# Altium schematic sheet DSDPLC_IO.SchDoc: DSD_PLC
size A3; Author: Nicolás Velásquez; CompanyName: DeepSea Developments
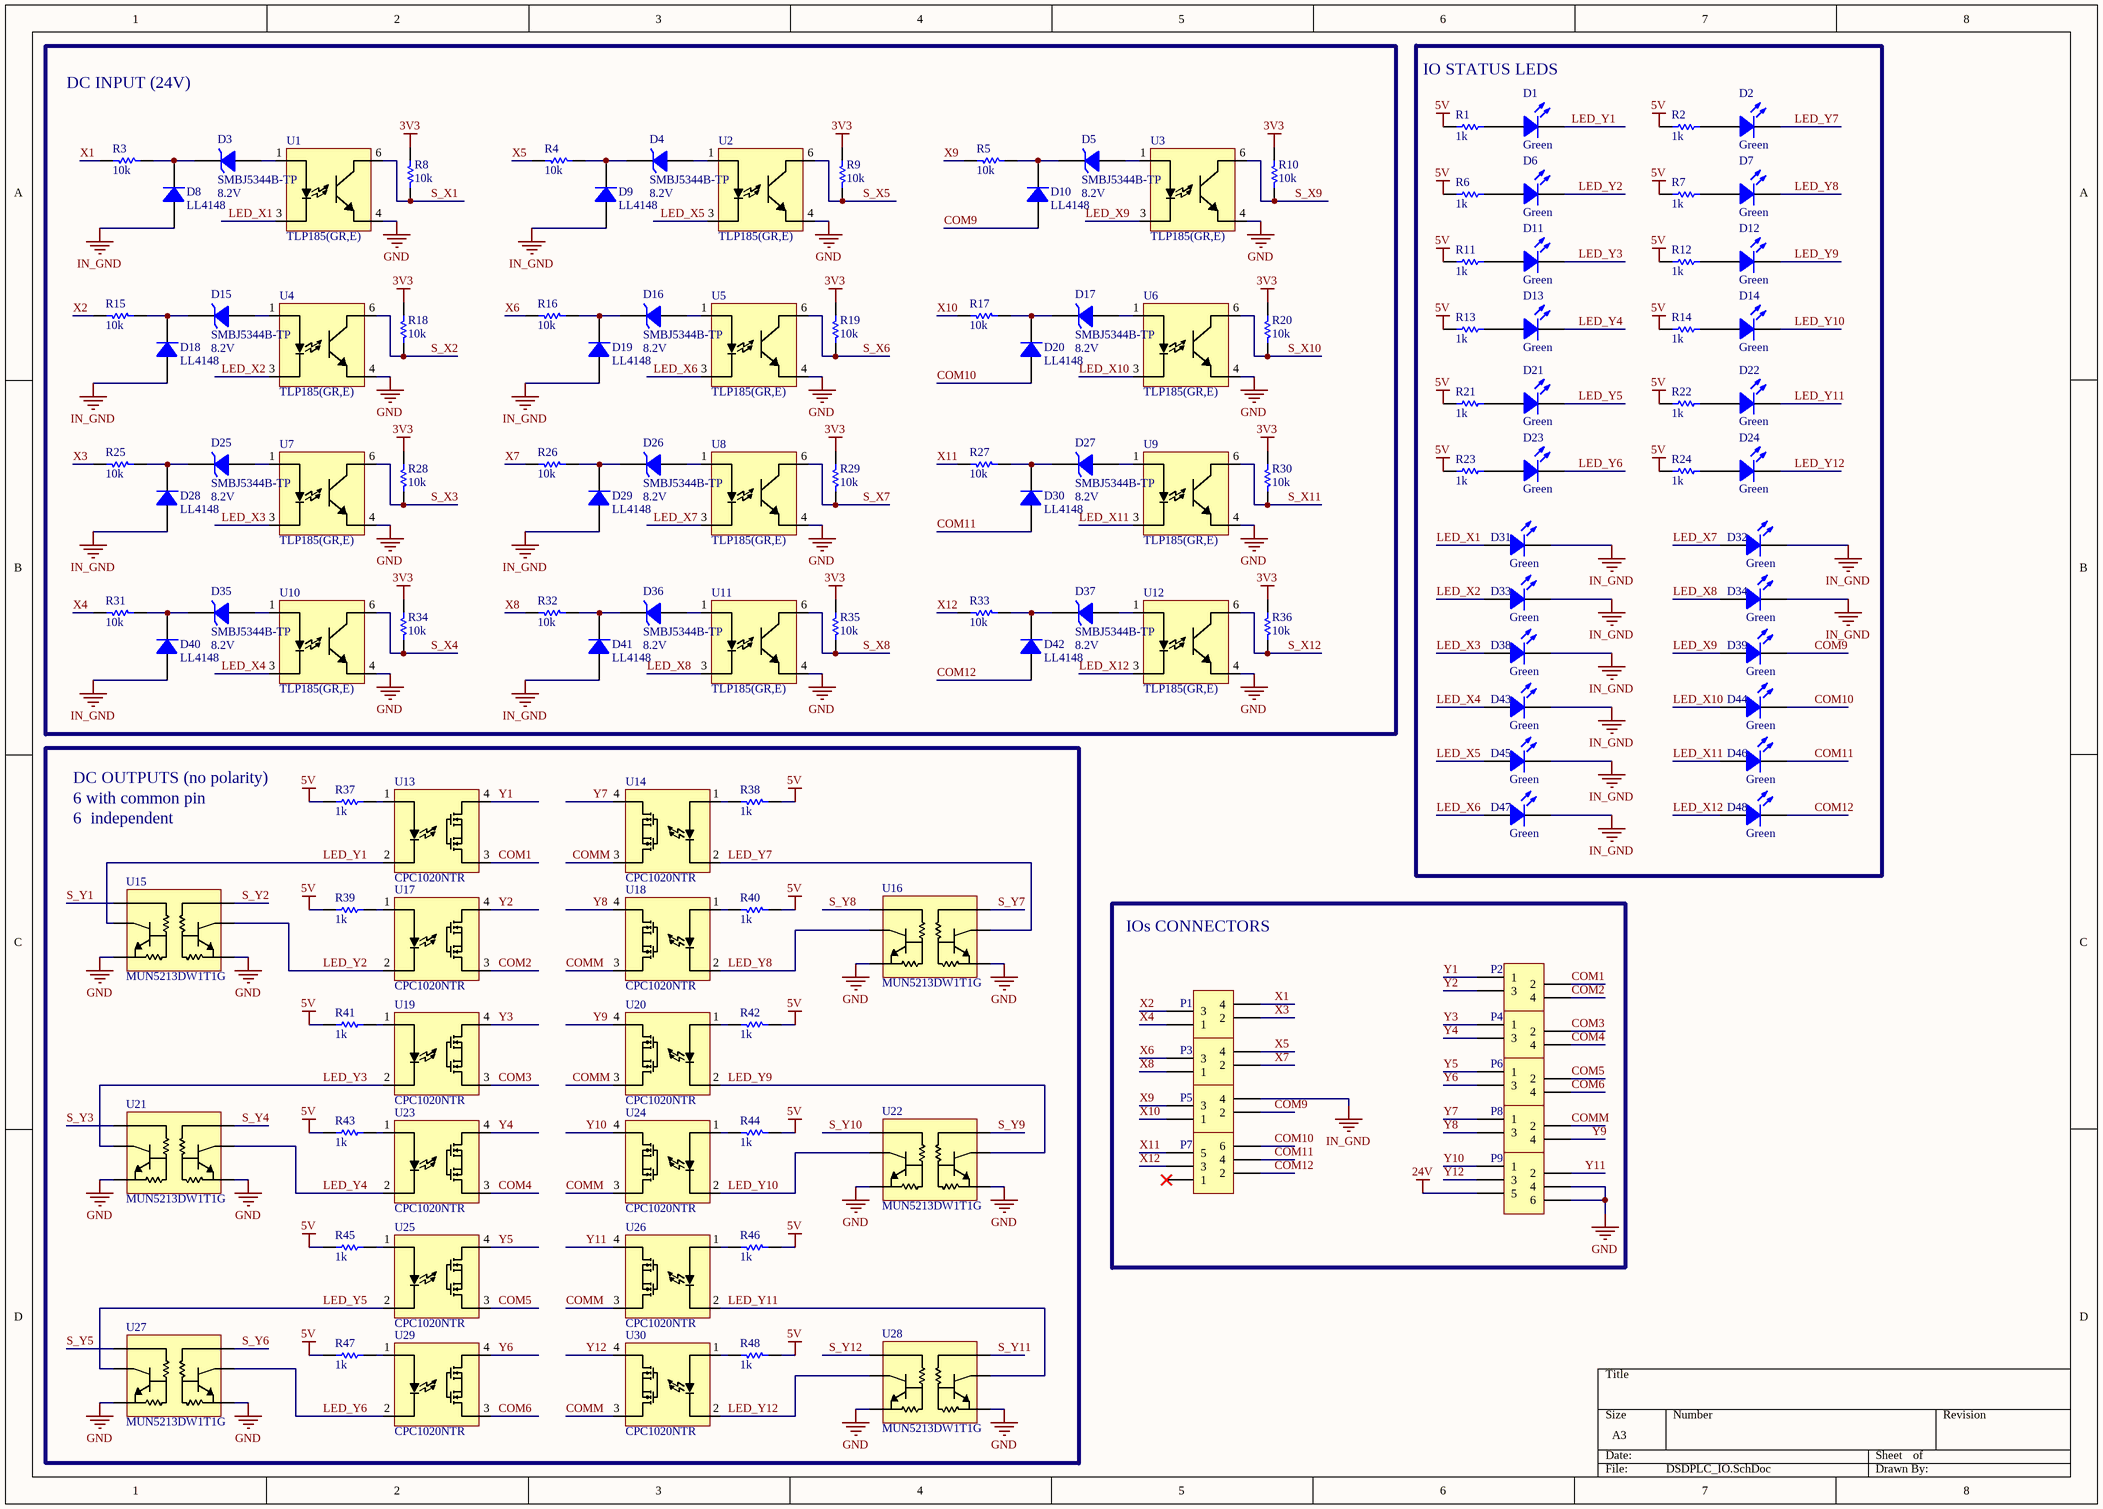
[diagram p0: DSDPLC_IO.SchDoc]

## Parts
D1  Green  [R0603_N]
D2  Green  [R0603_N]
D3  SMBJ5344B-TP  Voltage - Zener (Nom) (Vz): 8.2V  [SMB_N]
D4  SMBJ5344B-TP  Voltage - Zener (Nom) (Vz): 8.2V  [SMB_N]
D5  SMBJ5344B-TP  Voltage - Zener (Nom) (Vz): 8.2V  [SMB_N]
D6  Green  [R0603_N]
D7  Green  [R0603_N]
D8  LL4148  [SOD-80_N]
D9  LL4148  [SOD-80_N]
D10  LL4148  [SOD-80_N]
D11  Green  [R0603_N]
D12  Green  [R0603_N]
D13  Green  [R0603_N]
D14  Green  [R0603_N]
D15  SMBJ5344B-TP  Voltage - Zener (Nom) (Vz): 8.2V  [SMB_N]
D16  SMBJ5344B-TP  Voltage - Zener (Nom) (Vz): 8.2V  [SMB_N]
D17  SMBJ5344B-TP  Voltage - Zener (Nom) (Vz): 8.2V  [SMB_N]
D18  LL4148  [SOD-80_N]
D19  LL4148  [SOD-80_N]
D20  LL4148  [SOD-80_N]
D21  Green  [R0603_N]
D22  Green  [R0603_N]
D23  Green  [R0603_N]
D24  Green  [R0603_N]
D25  SMBJ5344B-TP  Voltage - Zener (Nom) (Vz): 8.2V  [SMB_N]
D26  SMBJ5344B-TP  Voltage - Zener (Nom) (Vz): 8.2V  [SMB_N]
D27  SMBJ5344B-TP  Voltage - Zener (Nom) (Vz): 8.2V  [SMB_N]
D28  LL4148  [SOD-80_N]
D29  LL4148  [SOD-80_N]
D30  LL4148  [SOD-80_N]
D31  Green  [R0603_N]
D32  Green  [R0603_N]
D33  Green  [R0603_N]
D34  Green  [R0603_N]
D35  SMBJ5344B-TP  Voltage - Zener (Nom) (Vz): 8.2V  [SMB_N]
D36  SMBJ5344B-TP  Voltage - Zener (Nom) (Vz): 8.2V  [SMB_N]
D37  SMBJ5344B-TP  Voltage - Zener (Nom) (Vz): 8.2V  [SMB_N]
D38  Green  [R0603_N]
D39  Green  [R0603_N]
D40  LL4148  [SOD-80_N]
D41  LL4148  [SOD-80_N]
D42  LL4148  [SOD-80_N]
D43  Green  [R0603_N]
D44  Green  [R0603_N]
D45  Green  [R0603_N]
D46  Green  [R0603_N]
D47  Green  [R0603_N]
D48  Green  [R0603_N]
P1  BLOCK_CONN2X2  [block_conn 2 x 2]  (value not drawn)
P2  BLOCK_CONN2X2  [block_conn 2 x 2]  (value not drawn)
P3  BLOCK_CONN2X2  [block_conn 2 x 2]  (value not drawn)
P4  BLOCK_CONN2X2  [block_conn 2 x 2]  (value not drawn)
P5  BLOCK_CONN2X2  [block_conn 2 x 2]  (value not drawn)
P6  BLOCK_CONN2X2  [block_conn 2 x 2]  (value not drawn)
P7  BLOCK_CONN2X3  [block_conn 2 x 3]  (value not drawn)
P8  BLOCK_CONN2X2  [block_conn 2 x 2]  (value not drawn)
P9  BLOCK_CONN2X3  [block_conn 2 x 3]  (value not drawn)
R1  value 1k  [R0603_N]  (hidden comment: R_SMD)
R2  value 1k  [R0603_N]  (hidden comment: R_SMD)
R3  value 10k  [R0603_N]  (hidden comment: R_SMD)
R4  value 10k  [R0603_N]  (hidden comment: R_SMD)
R5  value 10k  [R0603_N]  (hidden comment: R_SMD)
R6  value 1k  [R0603_N]  (hidden comment: R_SMD)
R7  value 1k  [R0603_N]  (hidden comment: R_SMD)
R8  value 10k  [R0603_N]  (hidden comment: R_SMD)
R9  value 10k  [R0603_N]  (hidden comment: R_SMD)
R10  value 10k  [R0603_N]  (hidden comment: R_SMD)
R11  value 1k  [R0603_N]  (hidden comment: R_SMD)
R12  value 1k  [R0603_N]  (hidden comment: R_SMD)
R13  value 1k  [R0603_N]  (hidden comment: R_SMD)
R14  value 1k  [R0603_N]  (hidden comment: R_SMD)
R15  value 10k  [R0603_N]  (hidden comment: R_SMD)
R16  value 10k  [R0603_N]  (hidden comment: R_SMD)
R17  value 10k  [R0603_N]  (hidden comment: R_SMD)
R18  value 10k  [R0603_N]  (hidden comment: R_SMD)
R19  value 10k  [R0603_N]  (hidden comment: R_SMD)
R20  value 10k  [R0603_N]  (hidden comment: R_SMD)
R21  value 1k  [R0603_N]  (hidden comment: R_SMD)
R22  value 1k  [R0603_N]  (hidden comment: R_SMD)
R23  value 1k  [R0603_N]  (hidden comment: R_SMD)
R24  value 1k  [R0603_N]  (hidden comment: R_SMD)
R25  value 10k  [R0603_N]  (hidden comment: R_SMD)
R26  value 10k  [R0603_N]  (hidden comment: R_SMD)
R27  value 10k  [R0603_N]  (hidden comment: R_SMD)
R28  value 10k  [R0603_N]  (hidden comment: R_SMD)
R29  value 10k  [R0603_N]  (hidden comment: R_SMD)
R30  value 10k  [R0603_N]  (hidden comment: R_SMD)
R31  value 10k  [R0603_N]  (hidden comment: R_SMD)
R32  value 10k  [R0603_N]  (hidden comment: R_SMD)
R33  value 10k  [R0603_N]  (hidden comment: R_SMD)
R34  value 10k  [R0603_N]  (hidden comment: R_SMD)
R35  value 10k  [R0603_N]  (hidden comment: R_SMD)
R36  value 10k  [R0603_N]  (hidden comment: R_SMD)
R37  value 1k  [R0603_N]  (hidden comment: R_SMD)
R38  value 1k  [R0603_N]  (hidden comment: R_SMD)
R39  value 1k  [R0603_N]  (hidden comment: R_SMD)
R40  value 1k  [R0603_N]  (hidden comment: R_SMD)
R41  value 1k  [R0603_N]  (hidden comment: R_SMD)
R42  value 1k  [R0603_N]  (hidden comment: R_SMD)
R43  value 1k  [R0603_N]  (hidden comment: R_SMD)
R44  value 1k  [R0603_N]  (hidden comment: R_SMD)
R45  value 1k  [R0603_N]  (hidden comment: R_SMD)
R46  value 1k  [R0603_N]  (hidden comment: R_SMD)
R47  value 1k  [R0603_N]  (hidden comment: R_SMD)
R48  value 1k  [R0603_N]  (hidden comment: R_SMD)
U1  TLP185(GR,E)  [SOIC6 (4 leads)]
U2  TLP185(GR,E)  [SOIC6 (4 leads)]
U3  TLP185(GR,E)  [SOIC6 (4 leads)]
U4  TLP185(GR,E)  [SOIC6 (4 leads)]
U5  TLP185(GR,E)  [SOIC6 (4 leads)]
U6  TLP185(GR,E)  [SOIC6 (4 leads)]
U7  TLP185(GR,E)  [SOIC6 (4 leads)]
U8  TLP185(GR,E)  [SOIC6 (4 leads)]
U9  TLP185(GR,E)  [SOIC6 (4 leads)]
U10  TLP185(GR,E)  [SOIC6 (4 leads)]
U11  TLP185(GR,E)  [SOIC6 (4 leads)]
U12  TLP185(GR,E)  [SOIC6 (4 leads)]
U13  CPC1020NTR  [SOP4_N]
U14  CPC1020NTR  [SOP4_N]
U15  MUN5213DW1T1G  [SOT363_N]
U16  MUN5213DW1T1G  [SOT363_N]
U17  CPC1020NTR  [SOP4_N]
U18  CPC1020NTR  [SOP4_N]
U19  CPC1020NTR  [SOP4_N]
U20  CPC1020NTR  [SOP4_N]
U21  MUN5213DW1T1G  [SOT363_N]
U22  MUN5213DW1T1G  [SOT363_N]
U23  CPC1020NTR  [SOP4_N]
U24  CPC1020NTR  [SOP4_N]
U25  CPC1020NTR  [SOP4_N]
U26  CPC1020NTR  [SOP4_N]
U27  MUN5213DW1T1G  [SOT363_N]
U28  MUN5213DW1T1G  [SOT363_N]
U29  CPC1020NTR  [SOP4_N]
U30  CPC1020NTR  [SOP4_N]

## Blocks framed on the sheet
DC INPUT (24V): D3-D5 D8-D10 D15-D20 D25-D30 D35-D37 D40-D42 R3-R5 R8-R10 R15-R20 R25-R36 U1-U12
IO STATUS LEDS: D1 D2 D6 D7 D11-D14 D21-D24 D31-D34 D38 D39 D43-D48 R1 R2 R6 R7 R11-R14 R21-R24
IOs CONNECTORS: P1-P9

## Nets
3V3: R8.2 R9.2 R10.2 R18.2 R19.2 R20.2 R28.2 R29.2 R30.2 R34.2 R35.2 R36.2
5V: R1.1 R2.1 R6.1 R7.1 R11.1 R12.1 R13.1 R14.1 R21.1 R22.1 R23.1 R24.1 R37.2 R38.2 R39.2 R40.2 R41.2 R42.2 R43.2 R44.2 R45.2 R46.2 R47.2 R48.2
24V: P9.5
GND: P9.4 P9.6 U1.4(DC-) U2.4(DC-) U3.4(DC-) U4.4(DC-) U5.4(DC-) U6.4(DC-) U7.4(DC-) U8.4(DC-) U9.4(DC-) U10.4(DC-) U11.4(DC-) U12.4(DC-) U15.1 U15.4 U16.1 U16.4 U21.1 U21.4 U22.1 U22.4 U27.1 U27.4 U28.1 U28.4
IN_GND: D8.1(A) D9.1(A) D18.1(A) D19.1(A) D28.1(A) D29.1(A) D31.2(K) D32.2(K) D33.2(K) D34.2(K) D38.2(K) D40.1(A) D41.1(A) D43.2(K) D45.2(K) D47.2(K) P5.4
COM1: P2.2 U13.3(DC-)
COM2: P2.4 U17.3(DC-)
COM3: P4.2 U19.3(DC-)
COM4: P4.4 U23.3(DC-)
COM5: P6.2 U25.3(DC-)
COM6: P6.4 U29.3(DC-)
COM9: D10.1(A) D39.2(K) P5.2
COM10: D20.1(A) D44.2(K) P7.6
COM11: D30.1(A) D46.2(K) P7.4
COM12: D42.1(A) D48.2(K) P7.2
COMM: P8.2 U14.3(DC-) U18.3(DC-) U20.3(DC-) U24.3(DC-) U26.3(DC-) U30.3(DC-)
LED_X1: D31.1(A) U1.3(control-)
LED_X2: D33.1(A) U4.3(control-)
LED_X3: D38.1(A) U7.3(control-)
LED_X4: D43.1(A) U10.3(control-)
LED_X5: D45.1(A) U2.3(control-)
LED_X6: D47.1(A) U5.3(control-)
LED_X7: D32.1(A) U8.3(control-)
LED_X8: D34.1(A) U11.3(control-)
LED_X9: D39.1(A) U3.3(control-)
LED_X10: D44.1(A) U6.3(control-)
LED_X11: D46.1(A) U9.3(control-)
LED_X12: D48.1(A) U12.3(control-)
LED_Y1: D1.2(K) U13.2(control-) U15.6(b)
LED_Y2: D6.2(K) U15.3 U17.2(control-)
LED_Y3: D11.2(K) U19.2(control-) U21.6(b)
LED_Y4: D13.2(K) U21.3 U23.2(control-)
LED_Y5: D21.2(K) U25.2(control-) U27.6(b)
LED_Y6: D23.2(K) U27.3 U29.2(control-)
LED_Y7: D2.2(K) U14.2(control-) U16.6(b)
LED_Y8: D7.2(K) U16.3 U18.2(control-)
LED_Y9: D12.2(K) U20.2(control-) U22.6(b)
LED_Y10: D14.2(K) U22.3 U24.2(control-)
LED_Y11: D22.2(K) U26.2(control-) U28.6(b)
LED_Y12: D24.2(K) U28.3 U30.2(control-)
S_X1: R8.1 U1.6(DC+)
S_X2: R18.1 U4.6(DC+)
S_X3: R28.1 U7.6(DC+)
S_X4: R34.1 U10.6(DC+)
S_X5: R9.1 U2.6(DC+)
S_X6: R19.1 U5.6(DC+)
S_X7: R29.1 U8.6(DC+)
S_X8: R35.1 U11.6(DC+)
S_X9: R10.1 U3.6(DC+)
S_X10: R20.1 U6.6(DC+)
S_X11: R30.1 U9.6(DC+)
S_X12: R36.1 U12.6(DC+)
S_Y1: U15.2
S_Y2: U15.5
S_Y3: U21.2
S_Y4: U21.5
S_Y5: U27.2
S_Y6: U27.5
S_Y7: U16.2
S_Y8: U16.5
S_Y9: U22.2
S_Y10: U22.5
S_Y11: U28.2
S_Y12: U28.5
X1: P1.4 R3.2
X2: P1.3 R15.2
X3: P1.2 R25.2
X4: P1.1 R31.2
X5: P3.4 R4.2
X6: P3.3 R16.2
X7: P3.2 R26.2
X8: P3.1 R32.2
X9: P5.3 R5.2
X10: P5.1 R17.2
X11: P7.5 R27.2
X12: P7.3 R33.2
Y1: P2.1 U13.4(DC+)
Y2: P2.3 U17.4(DC+)
Y3: P4.1 U19.4(DC+)
Y4: P4.3 U23.4(DC+)
Y5: P6.1 U25.4(DC+)
Y6: P6.3 U29.4(DC+)
Y7: P8.1 U14.4(DC+)
Y8: P8.3 U18.4(DC+)
Y9: P8.4 U20.4(DC+)
Y10: P9.1 U24.4(DC+)
Y11: P9.2 U26.4(DC+)
Y12: P9.3 U30.4(DC+)
NetD1_1: D1.1(A) R1.2
NetD2_1: D2.1(A) R2.2
NetD3_1: D3.1(A) U1.1(control+)
NetD3_2: D3.2(K) D8.2(K) R3.1
NetD4_1: D4.1(A) U2.1(control+)
NetD4_2: D4.2(K) D9.2(K) R4.1
NetD5_1: D5.1(A) U3.1(control+)
NetD5_2: D5.2(K) D10.2(K) R5.1
NetD6_1: D6.1(A) R6.2
NetD7_1: D7.1(A) R7.2
NetD11_1: D11.1(A) R11.2
NetD12_1: D12.1(A) R12.2
NetD13_1: D13.1(A) R13.2
NetD14_1: D14.1(A) R14.2
NetD15_1: D15.1(A) U4.1(control+)
NetD15_2: D15.2(K) D18.2(K) R15.1
NetD16_1: D16.1(A) U5.1(control+)
NetD16_2: D16.2(K) D19.2(K) R16.1
NetD17_1: D17.1(A) U6.1(control+)
NetD17_2: D17.2(K) D20.2(K) R17.1
NetD21_1: D21.1(A) R21.2
NetD22_1: D22.1(A) R22.2
NetD23_1: D23.1(A) R23.2
NetD24_1: D24.1(A) R24.2
NetD25_1: D25.1(A) U7.1(control+)
NetD25_2: D25.2(K) D28.2(K) R25.1
NetD26_1: D26.1(A) U8.1(control+)
NetD26_2: D26.2(K) D29.2(K) R26.1
NetD27_1: D27.1(A) U9.1(control+)
NetD27_2: D27.2(K) D30.2(K) R27.1
NetD35_1: D35.1(A) U10.1(control+)
NetD35_2: D35.2(K) D40.2(K) R31.1
NetD36_1: D36.1(A) U11.1(control+)
NetD36_2: D36.2(K) D41.2(K) R32.1
NetD37_1: D37.1(A) U12.1(control+)
NetD37_2: D37.2(K) D42.2(K) R33.1
NetR37_1: R37.1 U13.1(control+)
NetR38_1: R38.1 U14.1(control+)
NetR39_1: R39.1 U17.1(control+)
NetR40_1: R40.1 U18.1(control+)
NetR41_1: R41.1 U19.1(control+)
NetR42_1: R42.1 U20.1(control+)
NetR43_1: R43.1 U23.1(control+)
NetR44_1: R44.1 U24.1(control+)
NetR45_1: R45.1 U25.1(control+)
NetR46_1: R46.1 U26.1(control+)
NetR47_1: R47.1 U29.1(control+)
NetR48_1: R48.1 U30.1(control+)

Not connected (* = marked no-connect by the designer): P7 1*

## Notes on the sheet
- DC OUTPUTS (no polarity)
- 6 with common pin
- 6  independent

## Library data of the parts
D1 D2 D6 D7 D11-D14 D21-D24 D31-D34 D38 D39 D43-D48 = LED_SMD: Color: Green
D3-D5 D15-D17 D25-D27 D35-D37 = SMBJ5344B-TP: DIODE ZENER 8.2V 5W DO214AA; Manufacturer: Micro Commercial Co; Tolerance: ±5%; Impedance (Max) (Zzt): 1.5 Ohm; Current - Reverse Leakage @ Vr: 10µA @ 6.2V; Voltage - Forward (Vf) (Max) @ If: 1.2V @ 1A; Supplier 1: Digi-Key; Manufacturer Part Number: SMBJ5344B-TP; RoHS: RoHS Compliant; Category: Discrete Semiconductor Products; Stock 1: 15936; Pricing 1: 1=0.65, 10=0.57, 25=0.504, 100=0.4392, 250=0.38236, 500=0.32548, 1000=0.2607 (USD); Packaging: Cut Tape (CT); Power - Max: 5W; Operating Temperature: -55°C ~ 150°C; Mounting Type: Surface Mount; Package / Case: DO-214AA, SMB; Supplier Device Package: DO-214AA (SMB); ComponentLink1URL: http://www.mccsemi.com/up_pdf/SMBJ5338B-SMBJ5388B(SMB).pdf; ComponentLink1Description: http://www.mccsemi.com/up_pdf/SMBJ5338B-SMBJ5388B(SMB).pdf; Supplier Part Number 1: SMBJ5344B-TPMSCT-ND
D8-D10 D18-D20 D28-D30 D40-D42 = LL4148: DIODE SMALL SIG 100V 0.2A SOD80; Manufacturer: Fairchild Semiconductor; Diode Type: Standard; Current - Average Rectified (Io): 200mA; Voltage - Forward (Vf) (Max) @ If: 1V @ 10mA; Speed: Small Signal =< 200mA (Io), Any Speed; Reverse Recovery Time (trr): 4ns; Current - Reverse Leakage @ Vr: 25nA @ 20V; Capacitance @ Vr, F: 4pF @ 0V, 1MHz; Supplier 1: Digi-Key; Manufacturer Part Number: LL4148; RoHS: RoHS Compliant; Category: Discrete Semiconductor Products; Stock 1: 155674; Pricing 1: 1=0.1, 10=0.068, 25=0.062, 100=0.0445, 250=0.0262, 500=0.02174, 1000=0.01483 (USD); Packaging: Cut Tape (CT); Voltage - DC Reverse (Vr) (Max): 100V; Mounting Type: Surface Mount; Package / Case: SOD-80; Supplier Device Package: SOD-80; Operating Temperature - Junction: -55°C ~ 175°C; ComponentLink1URL: http://www.fairchildsemi.com/ds/LL/LL4148.pdf; ComponentLink1Description: http://www.fairchildsemi.com/ds/LL/LL4148.pdf; Supplier Part Number 1: LL4148FSCT-ND
P1-P6 P8 = BLOCK_CONN2X2: TERM BLOCK 2POS STACK 5.08MM PC; Manufacturer: TE Connectivity; Manufacturer Part Number: 796692-2; Number of Levels: 2; Pitch: 0.200" (5.08mm); Mating Orientation: Horizontal with Board; Current: 17.5A; Voltage: 300V; Wire Gauge: 12-30 AWG; Wire Termination: Screw - Rising Cage Clamp; Clamp Material - Plating: Brass - Tin Plated; Screw Material - Plating: Brass - Nickel Plated; Torque - Screw: 0.79 Nm (7.0 Lb-In); Screw Thread: M3; Supplier 1: Digi-Key; RoHS: RoHS Compliant; Category: Connectors, Interconnects; Stock 1: 978; Pricing 1: 1=2.66, 10=2.013, 25=1.866, 50=1.6778, 100=1.637, 250=1.43236, 500=1.30956, 1000=1.1868, 2500=1.06402 (USD); Packaging: Bulk; Positions Per Level: 2; Mounting Type: Through Hole; Features: Interlocking (Side); Color: Green; Operating Temperature: -; Housing Material: Polyamide (PA66), Nylon 6/6; Contact Material - Plating: Brass - Tin Plated; ComponentLink1URL: http://www.te.com/commerce/DocumentDelivery/DDEController?Action=srchrtrv&DocNm=796692&DocType=Customer+Drawing&DocLang=English; ComponentLink1Description: http://www.te.com/commerce/DocumentDelivery/DDEController?Action=srchrtrv&DocNm=796692&DocType=Customer+Drawing&DocLang=English; Supplier Part Number 1: A98450-ND
P7 P9 = BLOCK_CONN2X3: TERM BLOCK 3POS STACK 5.08MM PC; Manufacturer: TE Connectivity; Manufacturer Part Number: 796692-3; Number of Levels: 2; Positions Per Level: 3; Pitch: 0.200" (5.08mm); Mating Orientation: Horizontal with Board; Current: 17.5A; Voltage: 300V; Wire Gauge: 12-30 AWG; Wire Termination: Screw - Rising Cage Clamp; Clamp Material - Plating: Brass - Tin Plated; Screw Material - Plating: Brass - Nickel Plated; Torque - Screw: 0.79 Nm (7.0 Lb-In); Screw Thread: M3; Supplier 1: Digi-Key; RoHS: RoHS Compliant; Category: Connectors, Interconnects; Stock 1: 537; Pricing 1: 1=4.64, 25=3.312, 50=2.944, 100=2.88, 250=2.656, 500=2.4, 1000=2.128, 2500=2.04, 5000=2 (USD); Packaging: Bulk; Mounting Type: Through Hole; Features: Interlocking (Side); Color: Green; Operating Temperature: -; Housing Material: Polyamide (PA66), Nylon 6/6; Contact Material - Plating: Brass - Tin Plated; ComponentLink1URL: http://www.te.com/commerce/DocumentDelivery/DDEController?Action=srchrtrv&DocNm=796692&DocType=Customer+Drawing&DocLang=English; ComponentLink1Description: http://www.te.com/commerce/DocumentDelivery/DDEController?Action=srchrtrv&DocNm=796692&DocType=Customer+Drawing&DocLang=English; Supplier Part Number 1: A98266-ND
U1-U12 = TLP185(GR,E): OPTOISO 3.75KV TRANS 6-SO 4 LEAD; Manufacturer: Toshiba Semiconductor and Storage; Number of Channels: 1; Voltage - Isolation: 3750Vrms; Current Transfer Ratio (Min): 100% @ 5mA; Current Transfer Ratio (Max): 300% @ 5mA; Turn On / Turn Off Time (Typ): 9µs, 9µs; Rise / Fall Time (Typ): 5µs, 9µs; Input Type: DC; Output Type: Transistor; Voltage - Output (Max): 80V; Current - Output / Channel: 50mA; Voltage - Forward (Vf) (Typ): 1.25V; Vce Saturation (Max): 300mV; Supplier 1: Digi-Key; Manufacturer Part Number: TLP185(GR,E); RoHS: RoHS Compliant; Category: Isolators; Stock 1: 5555; Pricing 1: 1=0.53, 25=0.3412, 100=0.294, 250=0.26252, 500=0.22576, 1000=0.1743, 2500=0.1575, 5000=0.147 (USD); Packaging: Tube; Current - DC Forward (If) (Max): 50mA; Operating Temperature: -55°C ~ 110°C; Mounting Type: Surface Mount; Package / Case: 6-SMD (4 Leads), Gull Wing; Supplier Device Package: 6-SO, 4 Lead; ComponentLink1URL: http://www.semicon.toshiba.co.jp/docs/datasheet/en/Opto/TLP185_en_datasheet_120214.pdf; ComponentLink1Description: http://www.semicon.toshiba.co.jp/docs/datasheet/en/Opto/TLP185_en_datasheet_120214.pdf; Supplier Part Number 1: TLP185(GRE)-ND
U13 U14 U17-U20 U23-U26 U29 U30 = CPC1020NTR: RELAY OPTOMOS 1200MA 4-SOP; Manufacturer: IXYS Integrated Circuits Division; Circuit: SPST-NO (1 Form A); Output Type: AC, DC; On-State Resistance: 250 mOhm; Load Current: 1.2A; Voltage - Input: 1.2VDC; Voltage - Load: 0 ~ 30 V; Supplier 1: Digi-Key; Manufacturer Part Number: CPC1020NTR; RoHS: RoHS Compliant; Category: Relays; Stock 1: 34319; Pricing 1: 1=3.12, 10=2.808, 25=2.548, 100=2.288, 250=2.08, 500=1.82, 1000=1.56 (USD); Packaging: Cut Tape (CT); Mounting Type: Surface Mount; Termination Style: Gull Wing; Package / Case: 4-SOP (0.150", 3.81mm); Supplier Device Package: 4-SOP (2.54mm); Relay Type: Relay; ComponentLink1URL: http://www.clare.com/home/pdfs.nsf/www/CPC1020N.pdf/$file/CPC1020N.pdf; ComponentLink1Description: http://www.clare.com/home/pdfs.nsf/www/CPC1020N.pdf/$file/CPC1020N.pdf; Supplier Part Number 1: CLA318CT-ND
U15 U16 U21 U22 U27 U28 = MUN5213DW1T1G: TRANS PREBIAS DUAL NPN SOT363; Manufacturer: ON Semiconductor; Transistor Type: 2 NPN - Pre-Biased (Dual); Current - Collector (Ic) (Max): 100mA; Voltage - Collector Emitter Breakdown (Max): 50V; Resistor - Base (R1) (Ohms): 47k; DC Current Gain (hFE) (Min) @ Ic, Vce: 80 @ 5mA, 10V; Vce Saturation (Max) @ Ib, Ic: 250mV @ 300µA, 10mA; Current - Collector Cutoff (Max): 500nA; Power - Max: 250mW; Supplier 1: Digi-Key; Manufacturer Part Number: MUN5213DW1T1G; RoHS: RoHS Compliant; Category: Discrete Semiconductor Products; Stock 1: 9487; Pricing 1: 1=0.29, 10=0.265, 25=0.1908, 100=0.1485, 250=0.09332, 500=0.07952, 1000=0.05418 (USD); Packaging: Cut Tape (CT); Resistor - Emitter Base (R2) (Ohms): 47k; Frequency - Transition: -; Mounting Type: Surface Mount; Package / Case: 6-TSSOP, SC-88, SOT-363; Supplier Device Package: SC-88/SC70-6/SOT-363; ComponentLink1URL: http://www.onsemi.com/pub_link/Collateral/DTC144ED-D.PDF; ComponentLink1Description: http://www.onsemi.com/pub_link/Collateral/DTC144ED-D.PDF; Supplier Part Number 1: MUN5213DW1T1GOSCT-ND